# Altium schematic sheet BLE.SchDoc
size 594 x 420 mm; SheetNumber: 7; PageSetup: Record=PageOptions|CenterHorizontal=False|CenterVertical=False|PrintScale=0.43|XCorrection=0.00|YCorrection=0.00|PrintKind=1|BorderSize=5000000|LeftOffset=0|BottomOffset=0|Orientation=2|PaperLength=5940|PaperWidth=4200|Scale=100|PaperSource=7|PrintQuality=-4|MediaType=1|DitherType=10|PaperKind=Personal. 1: 215,9 x 279,4 mm|PrintScaleMode=0
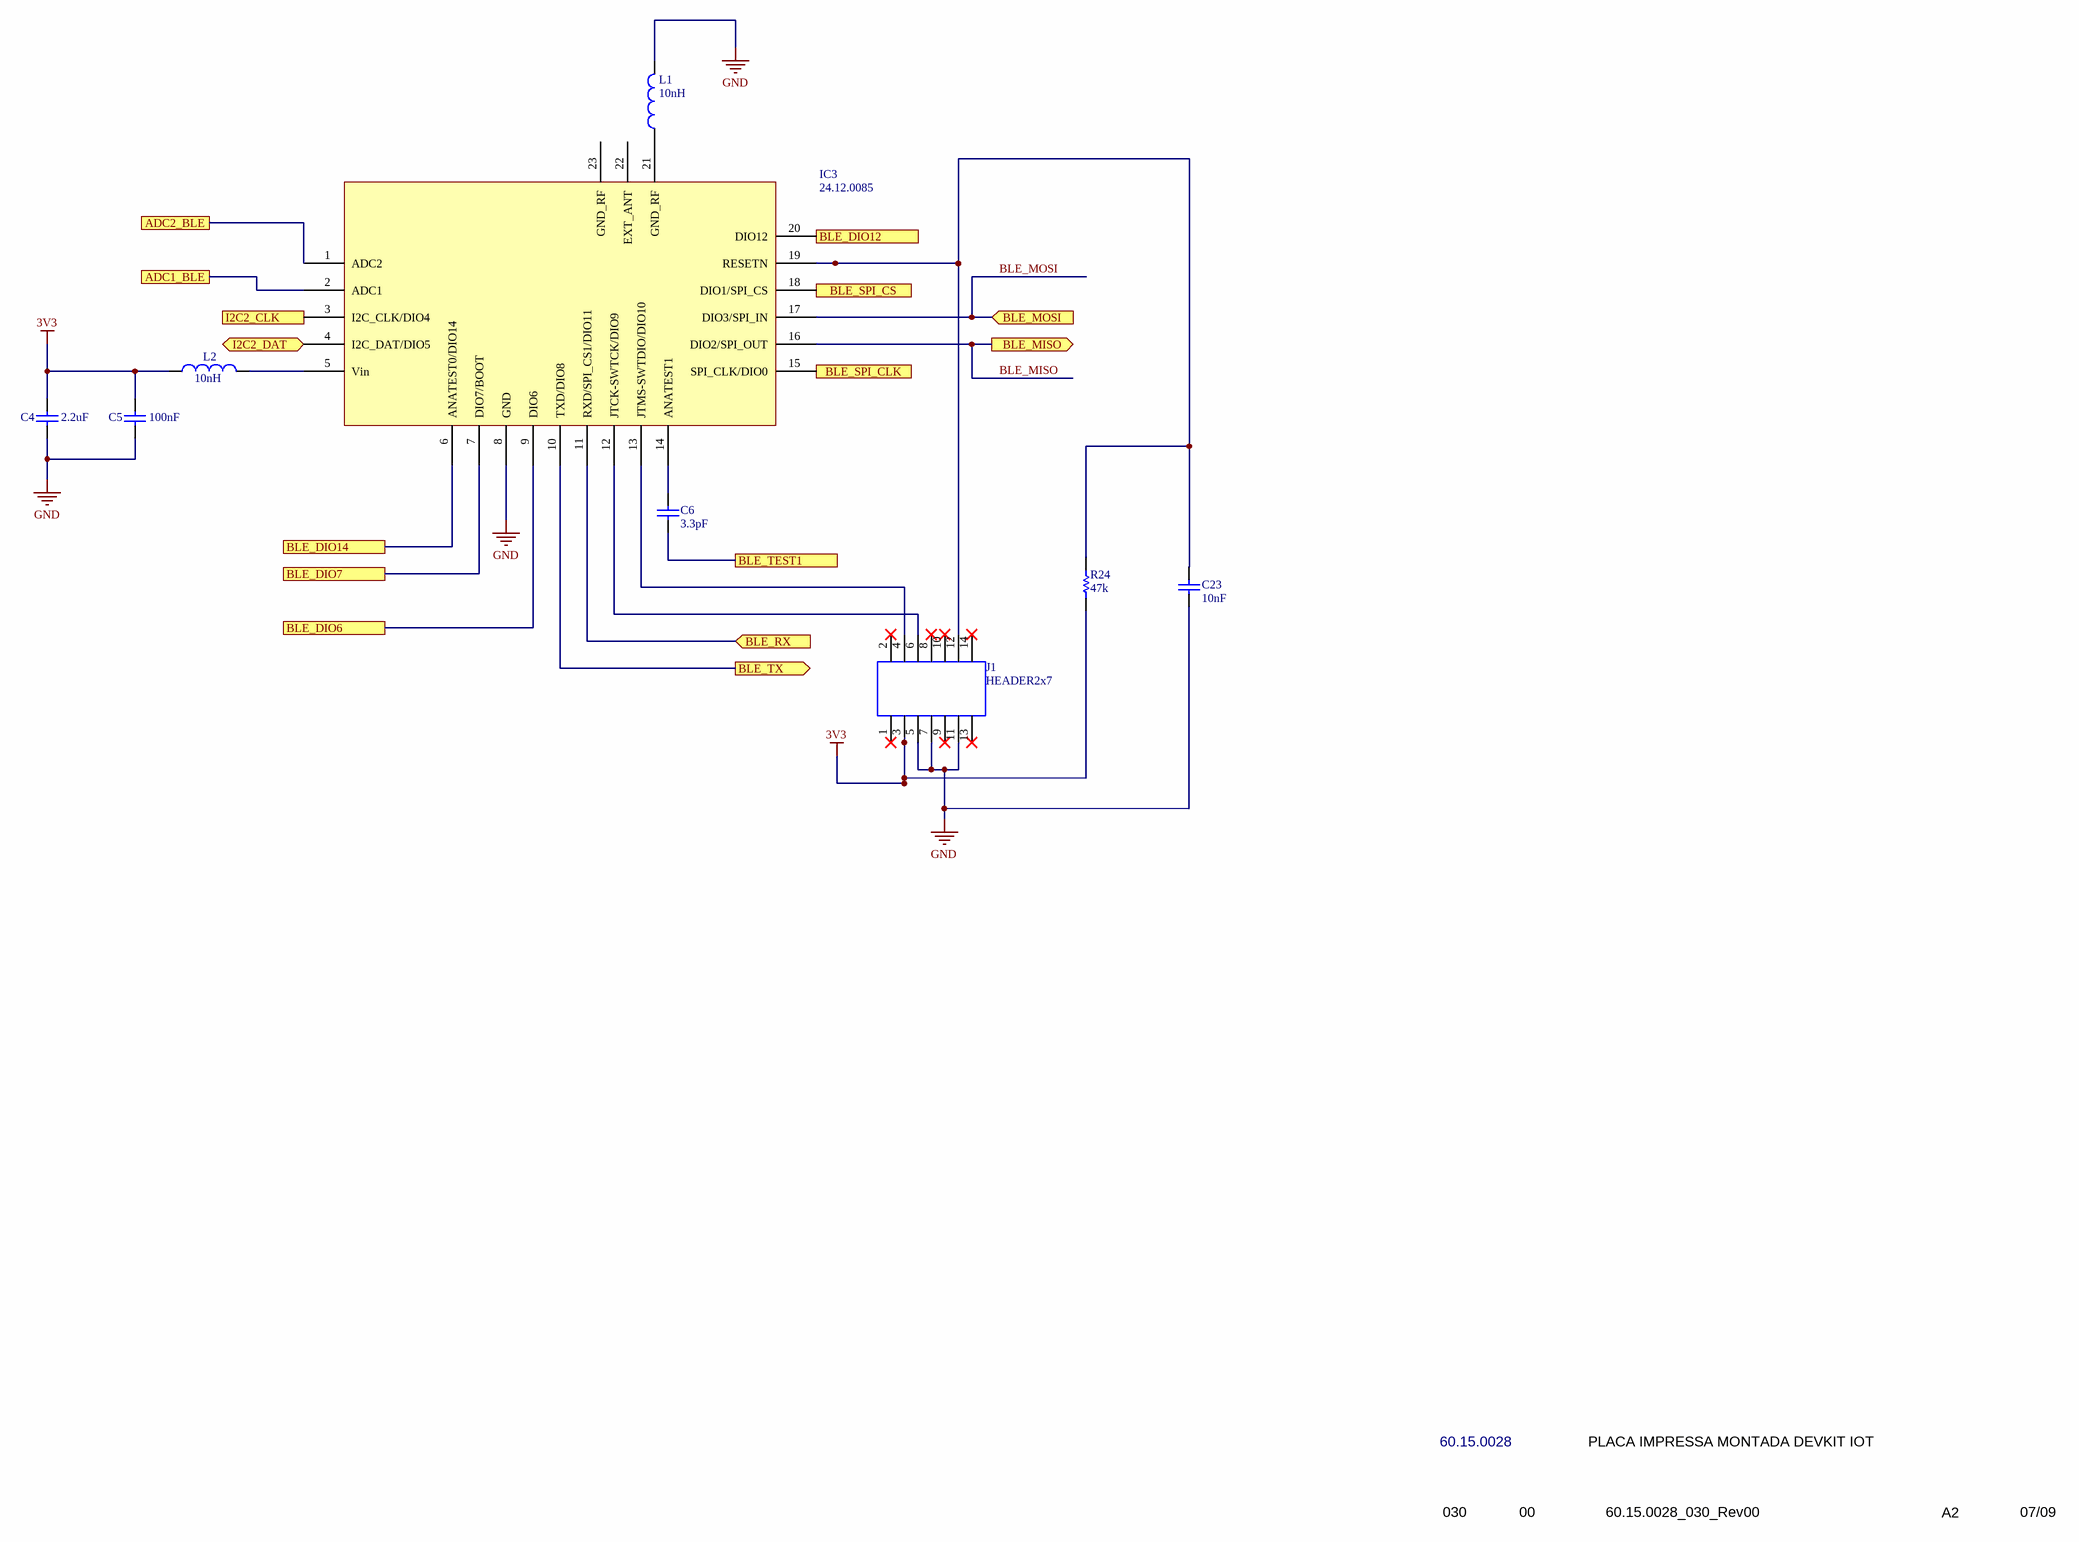
[diagram p0: BLE.SchDoc]

## Parts
C4  16.23.0334  [16.23.0334]  (value not drawn)
C5  value 100nF  [16.23.0278]  (hidden comment: 16.23.0278)
C6  16.23.0156  [16.23.0156]  (value not drawn)
C23  Adicionado  [0201]  (value not drawn)
IC3  24.12.0085  [24.12.0085]
J1  value HEADER2x7  [70.11.0077]  (hidden comment: 70.11.0077)
L1  value 10nH  [40.12.0348]  (hidden comment: 40.12.0348)
L2  value 10nH  [40.12.0348]  (hidden comment: 40.12.0348)
R24  value 47k  [0201]  (hidden comment: Adicionado)

## Ports
ADC1_BLE, ADC2_BLE, BLE_DIO6, BLE_DIO7, BLE_DIO12, BLE_DIO14, BLE_MISO (out), BLE_MOSI (in), BLE_RX (in), BLE_SPI_CLK (in), BLE_SPI_CS (in), BLE_TEST1, BLE_TX (out), I2C2_CLK (in), I2C2_DAT (bidir)

## Nets
3V3: C4.2 C5.2 J1.3 L2.1 R24.1
GND: C4.1 C5.1 C23.1 IC3.8(GND) J1.5 J1.7 J1.11 L1.2
ADC1_BLE: IC3.2(ADC1) ; port ADC1_BLE
ADC2_BLE: IC3.1(ADC2) ; port ADC2_BLE
BLE_DIO6: IC3.9(DIO6) ; port BLE_DIO6
BLE_DIO7: IC3.7(DIO7/BOOT) ; port BLE_DIO7
BLE_DIO12: IC3.20(DIO12) ; port BLE_DIO12
BLE_DIO14: IC3.6(ANATEST0/DIO14) ; port BLE_DIO14
BLE_MISO: IC3.16(DIO2/SPI_OUT) ; port BLE_MISO
BLE_MOSI: IC3.17(DIO3/SPI_IN) ; port BLE_MOSI
BLE_RX: IC3.11(RXD/SPI_CS1/DIO11) ; port BLE_RX
BLE_SPI_CLK: IC3.15(SPI_CLK/DIO0) ; port BLE_SPI_CLK
BLE_SPI_CS: IC3.18(DIO1/SPI_CS) ; port BLE_SPI_CS
BLE_TEST1: C6.1 ; port BLE_TEST1
BLE_TX: IC3.10(TXD/DIO8) ; port BLE_TX
I2C2_CLK: IC3.3(I2C_CLK/DIO4) ; port I2C2_CLK
I2C2_DAT: IC3.4(I2C_DAT/DIO5) ; port I2C2_DAT
NetC6_2: C6.2 IC3.14(ANATEST1)
NetC23_2: C23.2 IC3.19(RESETN) J1.12 R24.2
NetIC3_5: IC3.5(Vin) L2.2
NetIC3_12: IC3.12(JTCK-SWTCK/DIO9) J1.6
NetIC3_13: IC3.13(JTMS-SWTDIO/DIO10) J1.4
NetIC3_21: IC3.21(GND_RF) L1.1

Not connected (* = marked no-connect by the designer): IC3 22(EXT_ANT) 23(GND_RF); J1 1* 2* 8* 9* 10* 13* 14*

## Notes on the sheet
- 60.15.0028
- PLACA IMPRESSA MONTADA DEVKIT IOT
- 030
- 00
- 60.15.0028_030_Rev00
- A2
- 07/09
- 1
- 2
- 3
- 4
- 5
- 6
- 7
- 8
- A
- B
- C
- D
- E
- F
- G
- H
- DOCUMENTO DE ENGENHARIA DE PRODUTO
- DOCUMENT OF PRODUCT ENGINEERING
- CÓDIGO / CODE
- DESCRIÇÃO / DESCRIPTION
- DOC
- REV
- ARQUIVO / FILE
- FORM./SIZE
- FOLHA / PAGE
- (in symbol 16.23.0156) 3.3pF
- (in symbol 16.23.0334) 2.2uF
- (in symbol 02013D103KAT2A) 10nF

## Library data of the parts
C4 = 16.23.0334: CC 2.2UF 6.3V X5R 0402 SMD
C5 = 16.23.0278: CC X7R 100NF 16V 10% SMD 0603
C6 = 16.23.0156: CC SMD 3,3PF 50V 5% 0603
C23 = 02013D103KAT2A: CAPACITOR CERAMICO 10nF 25V 10% C0G SMD 0201
IC3 = 24.12.0085: CI MODULO DE COMUNICACAO BLUETOOTH DE BAIXO CONSUMO
J1 = 70.11.0077: BARRA PINOS 2X7 1,27mm VERTICAL MACHO; Part Number: 67997-428HLF; Manufactor: AMPHENOL FCI
L1 L2 = 40.12.0348: INDUTOR FIXO 10nH 3% 500mA 260mOHM 0402; Manufactor: MURATA; Part Number: LQG15HS10NH02D
R24 = CRCW020147K0FNED: RESISTOR THICK FILM 47k OHMS 30V 50mW 1% SMD 0201